# Altium project Multivibrator.PrjPCB
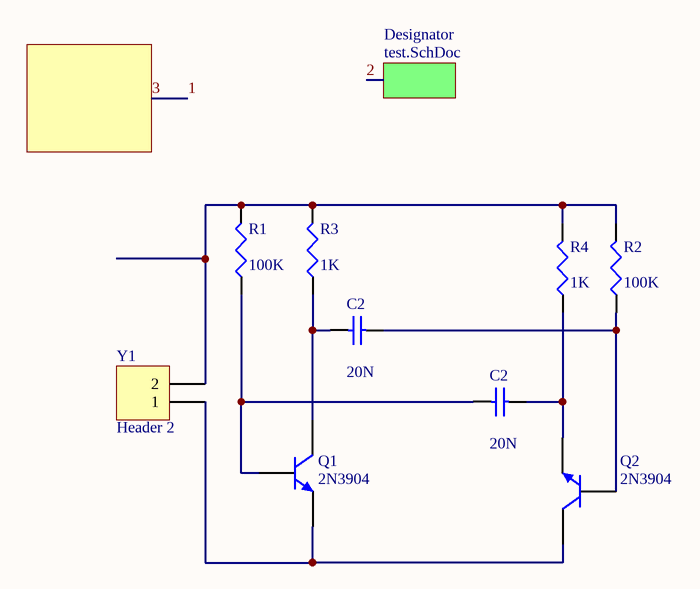
[diagram p0: Multivibrator.SchDoc]
2 sheets, 10 parts. Net scope: flat (ports and power ports of the same name join across sheets).
Sheets:
  Multivibrator.SchDoc
    Designator = test.SchDoc

## Sheet Multivibrator.SchDoc
size A4

### Parts
(Parts that share a designator on the sheet are numbered #1, #2 ... from top to bottom, then left to right.)
C2#1  value 20N  [RAD-0.3]  (hidden comment: Cap)
C2#2  value 20N  [RAD-0.3]  (hidden comment: Cap)
Q1  2N3904  [BCY-W3/E4]
Q2  2N3904  [BCY-W3/E4]
R1  value 100K  [RESC1608L]  (hidden comment: Res3)
R2  value 100K  [RESC1608L]  (hidden comment: Res3)
R3  value 1K  [RESC1608L]  (hidden comment: Res3)
R4  value 1K  [RESC1608L]  (hidden comment: Res3)
Y1  Header 2  [HDR1X2]

### Sub-sheets
Designator = test.SchDoc: no entries

### Nets
NetC2#1_1: C2#1.1 Q1.3(C) R3.1
NetC2#1_2: C2#1.2 Q2.2(B) R2.1
NetC2#2_1: C2#2.1 Q1.2(B) R1.1
NetC2#2_2: C2#2.2 Q2.1(E) R4.1
NetQ1_1: Q1.1(E) Q2.3(C) Y1.1
NetR1_2: R1.2 R2.2 R3.2 R4.2 Y1.2

### Library data of the parts
C2#1 C2#2 = Cap: Capacitor; Published: 8-Jun-2000; LatestRevisionDate: 17-Jul-2002; LatestRevisionNote: Re-released for DXP Platform.; PackageReference: RAD-0.3; Publisher: Altium Limited
Q1 Q2 = 2N3904: NPN General Purpose Amplifier; Published: 8-Jun-2000; LatestRevisionDate: 15-Jan-2003; LatestRevisionNote: PCB Footprint 'BCY-W3/D4.7' replaced; DatasheetVersion: 1997; PackageVersion: Sep-1998; PackageReference: TO-92A; Publisher: Altium Limited; Code_JEDEC: TO-92A; ComponentLink1Description: Manufacturer Link; ComponentLink1URL: http://www.fairchildsemi.com/; ComponentLink2Description: Datasheet; ComponentLink2URL: http://www.fairchildsemi.com/ds/2N%2F2N3904.pdf
R1-R4 = Res3: Resistor; Published: 8-Jun-2000; LatestRevisionDate: 29-May-2009; LatestRevisionNote: IPC-7351 Footprint Added.; PackageReference: J1-0603; Publisher: Altium Limited; PackageDescription: Chip Resistor
Y1 = Header 2: Header, 2-Pin; LatestRevisionDate: 17-Jul-2002; LatestRevisionNote: Re-released for DXP Platform.; Publisher: Altium Limited

## Sheet test.SchDoc
size A4
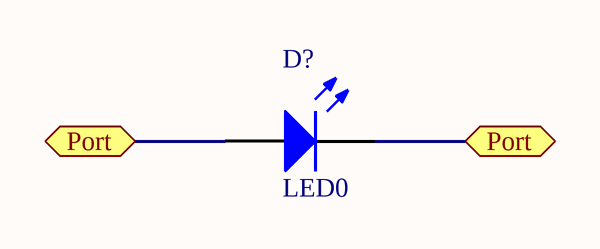
[diagram p1: test.SchDoc]

### Parts
D?  LED0  [LED-0]

### Ports
Port

### Nets
NetD?_1: D?.1(A) D?.2(K) ; port Port

### Library data of the parts
D? = LED0: Typical INFRARED GaAs LED; Published: 8-Jun-2000; LatestRevisionDate: 08-Jul-2005; LatestRevisionNote: Mech Layer 1 removed.; PackageReference: LED-0; Publisher: Altium Limited